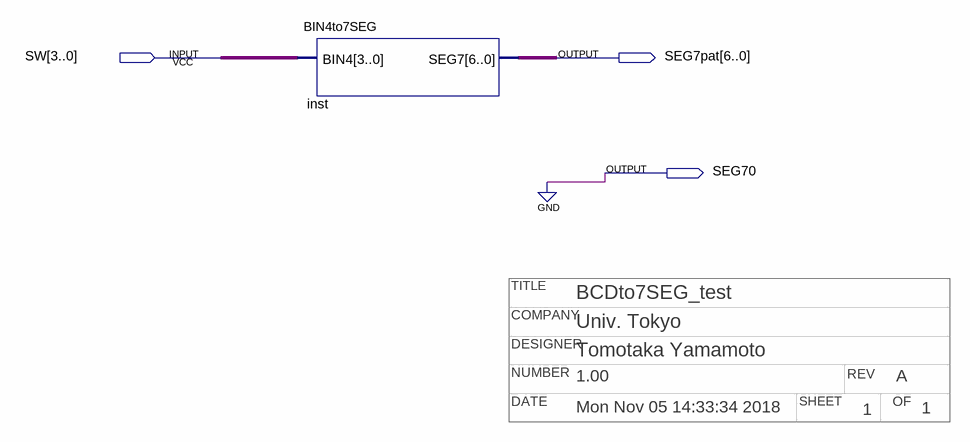
[diagram p0: schematic sheet]
// Quartus schematic BIN4to7SEGtest.bdf as structural Verilog: 1 symbols, 3 pins
// Title block: COMPANY: Univ. Tokyo; DATE: Mon Nov 05 14:33:34 2018; DESIGNER: Tomotaka Yamamoto; NUMBER: 1.00; OF: 1; REV: A; SHEET: 1; TITLE: BCDto7SEG_test
module BIN4to7SEGtest (
  input  [3:0] SW,
  output [6:0] SEG7pat,
  output SEG70
);

  BIN4to7SEG inst (.BIN4(SW), .SEG7(SEG7pat));

  assign SEG70 = 1'b0;
endmodule
